# Altium schematic sheet sensor_matrix_02.SchDoc
size A; SheetNumber: 2; SheetTotal: 5
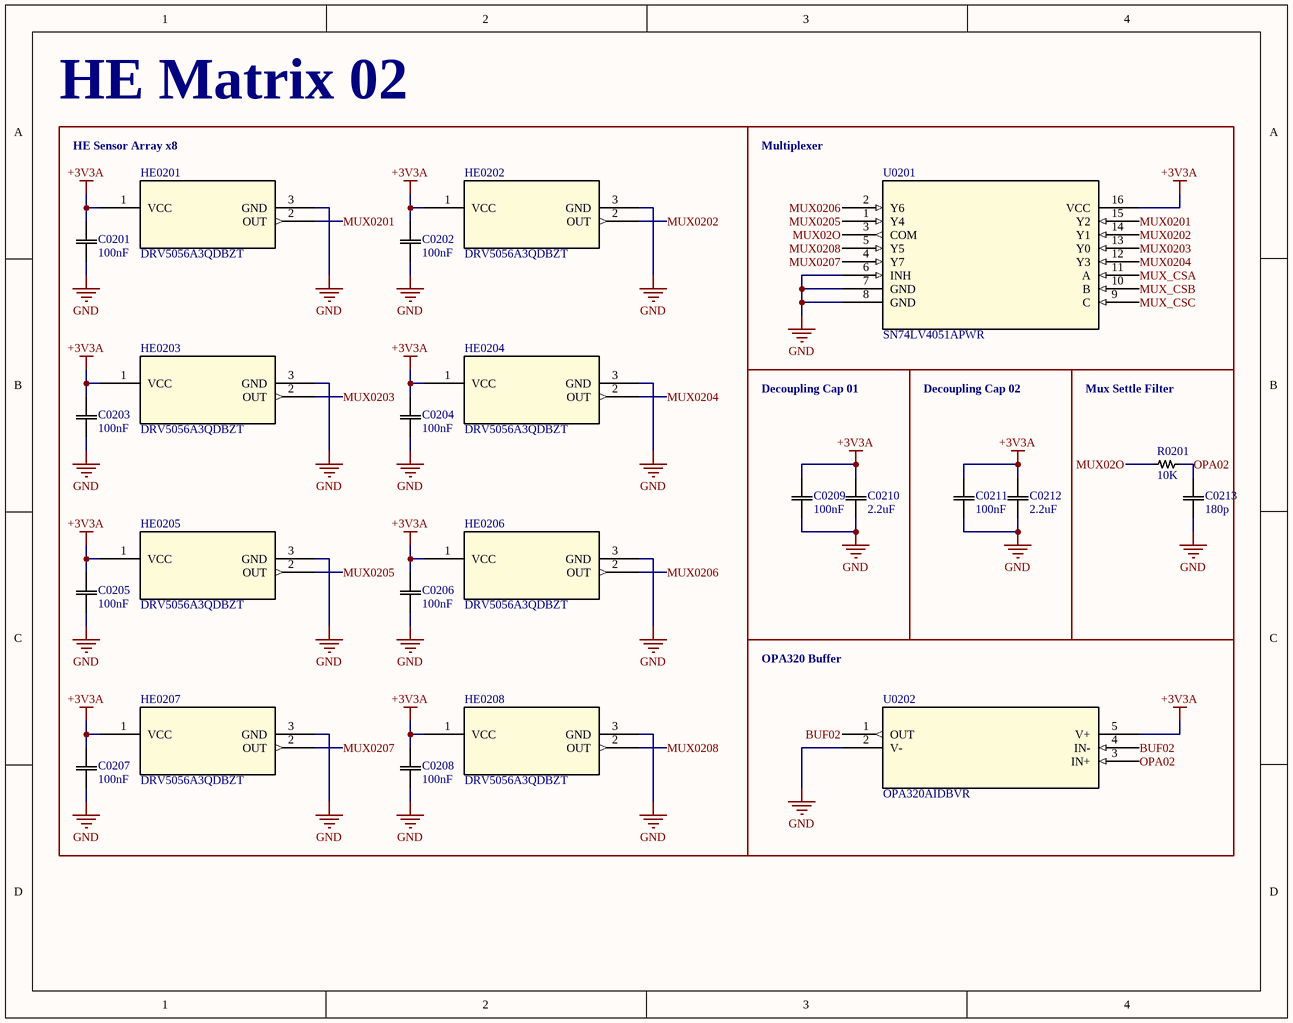
[diagram p0: sensor_matrix_02.SchDoc]

## Parts
C0201  100nF  [CAPC10555_55N_KEM]
C0202  100nF  [CAPC10555_55N_KEM]
C0203  100nF  [CAPC10555_55N_KEM]
C0204  100nF  [CAPC10555_55N_KEM]
C0205  100nF  [CAPC10555_55N_KEM]
C0206  100nF  [CAPC10555_55N_KEM]
C0207  100nF  [CAPC10555_55N_KEM]
C0208  100nF  [CAPC10555_55N_KEM]
C0209  100nF  [CAPC10555_55N_KEM]
C0210  2.2uF  [CAPC10555_55N_KEM]
C0211  100nF  [CAPC10555_55N_KEM]
C0212  2.2uF  [CAPC10555_55N_KEM]
C0213  180p  [CAPC10555_55N_KEM]
HE0201  DRV5056A3QDBZT  [DBZ3_TEX]
HE0202  DRV5056A3QDBZT  [DBZ3_TEX]
HE0203  DRV5056A3QDBZT  [DBZ3_TEX]
HE0204  DRV5056A3QDBZT  [DBZ3_TEX]
HE0205  DRV5056A3QDBZT  [DBZ3_TEX]
HE0206  DRV5056A3QDBZT  [DBZ3_TEX]
HE0207  DRV5056A3QDBZT  [DBZ3_TEX]
HE0208  DRV5056A3QDBZT  [DBZ3_TEX]
R0201  10K  [RES0402_CPF_TYCO_TYC]
U0201  SN74LV4051APWR  [PW16]
U0202  OPA320AIDBVR  [DBV5]

## Blocks framed on the sheet
HE Matrix 02: C0201 C0202 C0203 C0204 C0205 C0206 C0207 C0208 HE0201 HE0202 HE0203 HE0204 HE0205 HE0206 HE0207 HE0208
Multiplexer: U0201
OPA320 Buffer: U0202

## Nets
+3V3A: C0201.2 C0202.2 C0203.2 C0204.2 C0205.2 C0206.2 C0207.2 C0208.2 C0209.2 C0210.2 C0211.2 C0212.2 HE0201.1(VCC) HE0202.1(VCC) HE0203.1(VCC) HE0204.1(VCC) HE0205.1(VCC) HE0206.1(VCC) HE0207.1(VCC) HE0208.1(VCC) U0201.16(VCC) U0202.5(V+)
GND: C0201.1 C0202.1 C0203.1 C0204.1 C0205.1 C0206.1 C0207.1 C0208.1 C0209.1 C0210.1 C0211.1 C0212.1 C0213.1 HE0201.3(GND) HE0202.3(GND) HE0203.3(GND) HE0204.3(GND) HE0205.3(GND) HE0206.3(GND) HE0207.3(GND) HE0208.3(GND) U0201.6(INH) U0201.7(GND) U0201.8(GND) U0202.2(V-)
BUF02: U0202.1(OUT) U0202.4(IN-)
MUX02O: R0201.2 U0201.3(COM)
MUX0201: HE0201.2(OUT) U0201.15(Y2)
MUX0202: HE0202.2(OUT) U0201.14(Y1)
MUX0203: HE0203.2(OUT) U0201.13(Y0)
MUX0204: HE0204.2(OUT) U0201.12(Y3)
MUX0205: HE0205.2(OUT) U0201.1(Y4)
MUX0206: HE0206.2(OUT) U0201.2(Y6)
MUX0207: HE0207.2(OUT) U0201.4(Y7)
MUX0208: HE0208.2(OUT) U0201.5(Y5)
MUX_CSA: U0201.11(A)
MUX_CSB: U0201.10(B)
MUX_CSC: U0201.9(C)
OPA02: C0213.2 R0201.1 U0202.3(IN+)

## Notes on the sheet
- HE Sensor Array x8
- Decoupling Cap 01
- Decoupling Cap 02
- Mux Settle Filter

## Library data of the parts
C0201 C0202 C0203 C0204 C0205 C0206 C0207 C0208 C0209 C0210 C0211 C0212 C0213 = C0402: SMD Comm X7R, Ceramic, SMD, MLCC, Temperature Stable, 0402; Manufacturer_Name: Kemet; Manufacturer_Part_Number: C0402C104K4RACTU; Copyright: Copyright (C) 2025 Ultra Librarian. All rights reserved.; Datasheet: https://content.kemet.com/datasheets/KEM_C1002_X7R_SMD.pdf
HE0201 HE0202 HE0203 HE0204 HE0205 HE0206 HE0207 HE0208 = DRV5056A3QDBZT: Ratiometric unipolar linear hall effect sensor with analog output 3-SOT-23 -40 to 125; Manufacturer_Name: Texas Instruments; Copyright: Copyright (C) 2025 Ultra Librarian. All rights reserved.; Manufacturer_Part_Number: DRV5056A3QDBZT; Datasheet: https://www.ti.com/lit/gpn/drv5056; RefDes: RefDes; Type: Type
R0201 = R0402: CPF 0402 RL; Manufacturer_Name: TE Connectivity; Manufacturer_Part_Number: CPF0402B33RE1; Copyright: Copyright (C) 2025 Ultra Librarian. All rights reserved.; Datasheet: https://www.te.com/commerce/DocumentDelivery/DDEController?Action=srchrtrv&DocNm=1773200&DocType=Data+Sheet&DocLang=English&PartCntxt=1-1879208-3&DocFormat=pdf
U0201 = SN74LV4051APWR: 5V 8:1 one-channel general-purpose analog multiplexer 16-TSSOP -40 to 85; Manufacturer_Name: Texas Instruments; Copyright: Copyright (C) 2025 Ultra Librarian. All rights reserved.; Manufacturer_Part_Number: SN74LV4051APWR; Datasheet: https://www.ti.com/lit/gpn/sn74lv4051a; RefDes: RefDes; Type: Type
U0202 = OPA320AIDBVR: Precision, zero-crossover, 20-MHz, 0.9-pA Ib, RRIO, CMOS operational amplifier 5-SOT-23 -40 to 125; Manufacturer_Name: Texas Instruments; Copyright: Copyright (C) 2025 Ultra Librarian. All rights reserved.; Manufacturer_Part_Number: OPA320AIDBVR; Datasheet: https://www.ti.com/lit/gpn/opa320; RefDes: RefDes; Type: Type